# Altium schematic sheet [3]-MCU.SchDoc
size A4
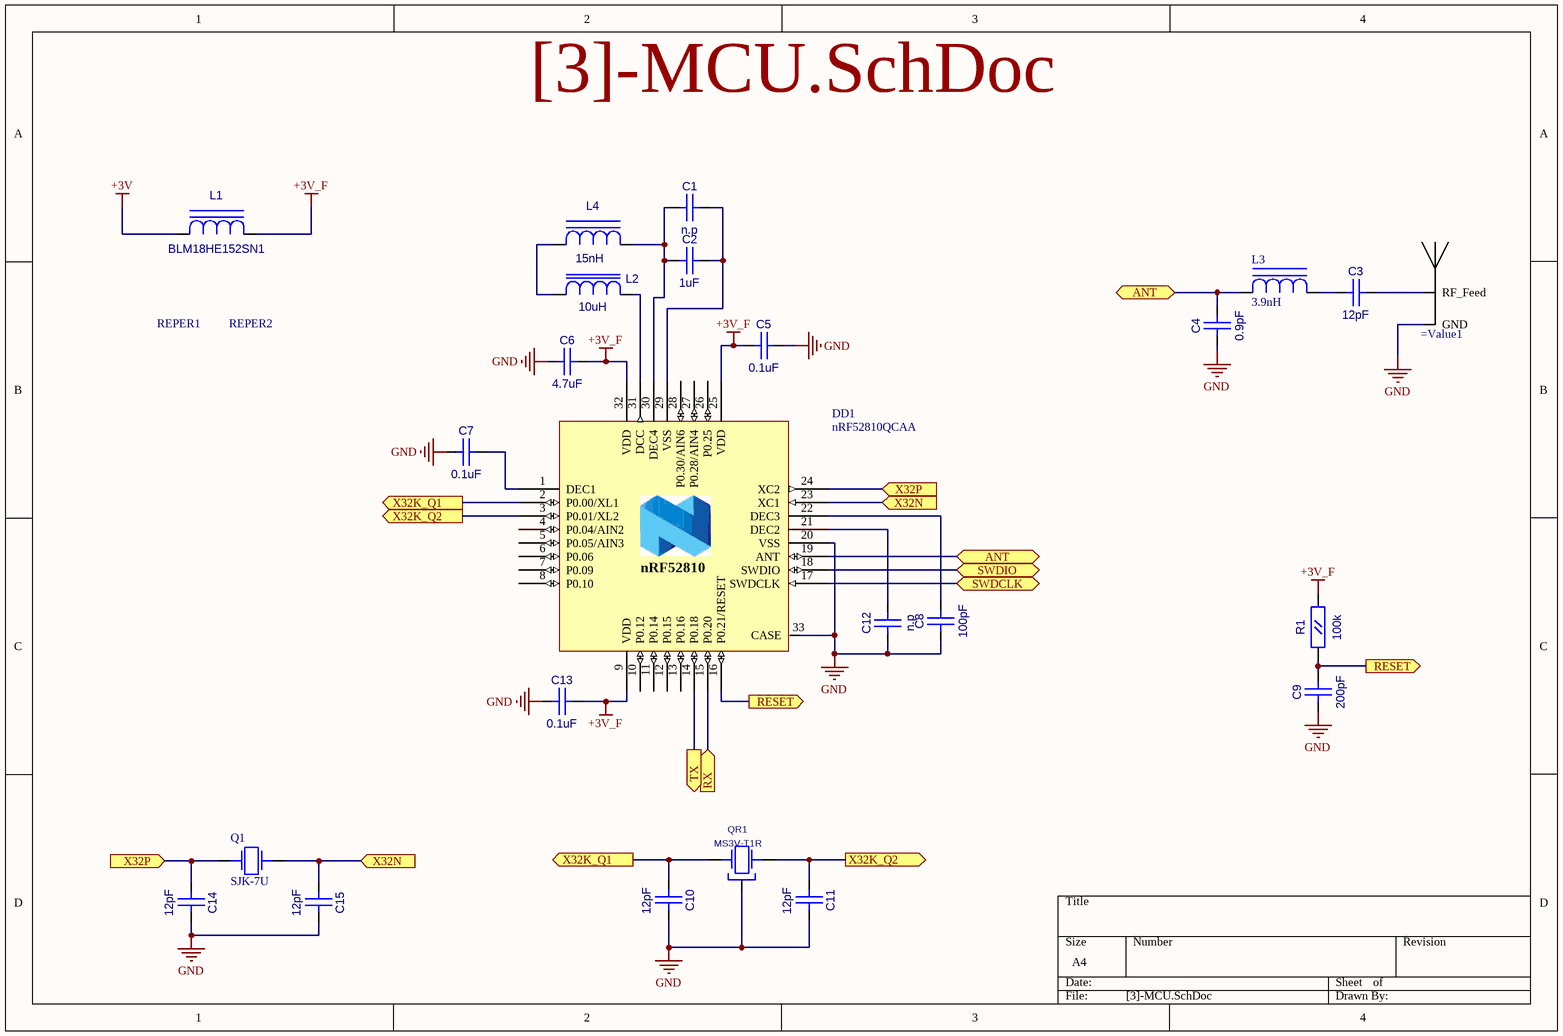
[diagram p0: [3]-MCU.SchDoc]

## Parts
=Value1  ANTENNA_IFA_245_1MM  [IFA245_1mm]  (value not drawn)
C1  n.p  [CC0805]
C2  1uF  [CC0603]
C3  12pF  [CC0603]
C4  0.9pF  [CC0603]
C5  0.1uF  [CC0603]
C6  4.7uF  [CC0805]
C7  0.1uF  [CC0603]
C8  100pF  [CC0603]
C9  200pF  [CC0603]
C10  12pF  [CC0603]
C11  12pF  [CC0603]
C12  n.p  [CC0603]
C13  0.1uF  [CC0603]
C14  12pF  [CC0603]
C15  12pF  [CC0603]
DD1  nRF52810QCAA  [QFN-32]
L1  BLM18HE152SN1  [L0603]
L2  10uH  [RC0805]
L3  3.9nH  [L0402]
L4  value 15nH  [L0603]  (hidden comment: L0603)
Q1  SJK-7U  [QUARTZ_3225_4]
QR1  MS3V-T1R  [MS3V-T1R]
R1  100k  [RC0603]
REPER1  REPER1.2  [REPER1.2]  (value not drawn)
REPER2  REPER1.2  [REPER1.2]  (value not drawn)

## Ports
ANT (bidir), RESET (out), RX (in), SWDCLK (bidir), SWDIO (bidir), TX (out), X32K_Q1 (out), X32K_Q2 (out), X32N (in), X32P (in)

## Nets
+3V: L1.1(A)
+3V_F: C5.1(A) C6.2(B) C13.2(B) DD1.9(VDD) DD1.25(VDD) DD1.32(VDD) L1.2(C) R1.2(B)
GND: =Value1.2(GND) C4.1(A) C5.2(B) C6.1(A) C7.1(A) C8.1(A) C9.1(A) C10.2(B) C11.2(B) C12.1(A) C13.1(A) C14.2(B) C15.2(B) DD1.20(VSS) DD1.33(CASE) QR1.3
ANT: C4.2(B) DD1.19(ANT) L3.1(A) ; port ANT
RESET: C9.2(B) DD1.16(P0.21/RESET) R1.1(A) ; port RESET
RX: DD1.15(P0.20) ; port RX
SWDCLK: DD1.17(SWDCLK) ; port SWDCLK
SWDIO: DD1.18(SWDIO) ; port SWDIO
TX: DD1.14(P0.18) ; port TX
X32K_Q1: C10.1(A) DD1.2(P0.00/XL1) QR1.2(X2) ; port X32K_Q1
X32K_Q2: C11.1(A) DD1.3(P0.01/XL2) QR1.1(X1) ; port X32K_Q2
X32N: C15.1(A) DD1.23(XC1) Q1.3 ; port X32N
X32P: C14.1(A) DD1.24(XC2) Q1.1 ; port X32P
Net=Value1_1: =Value1.1(RF_Feed) C3.2(B)
NetC1_1: C1.1(A) C2.1(A) DD1.30(DEC4) L4.2(C)
NetC1_2: C1.2(B) C2.2(B) DD1.29(VSS)
NetC3_1: C3.1(A) L3.2(C)
NetC7_2: C7.2(B) DD1.1(DEC1)
NetC8_2: C8.2(B) DD1.22(DEC3)
NetC12_2: C12.2(B) DD1.21(DEC2)
NetDD1_31: DD1.31(DCC) L2.2(B)
NetL2_1: L2.1(A) L4.1(A)

Not connected (* = marked no-connect by the designer): DD1 4(P0.04/AIN2) 5(P0.05/AIN3) 6(P0.06) 7(P0.09) 8(P0.10) 10(P0.12) 11(P0.14) 12(P0.15) 13(P0.16) 26(P0.25) 27(P0.28/AIN4) 28(P0.30/AIN6); REPER1 1; REPER2 1

## Notes on the sheet
- (in symbol NRF52810QCAA) nRF52810

## Library data of the parts
=Value1 = ANTENNA_IFA_245_1MM: Antenna 2.45GHz; Value: IFA 2.45GHz
C1 C6 = CC0805
  C1: Value: n.p
  C6: Value: 4.7uF
C2-C5 C7-C15 = CC0603
  C2: Value: 1uF
  C3 C10 C11 C14 C15: Value: 12pF
  C4: Value: 0.9pF
  C5 C7 C13: Value: 0.1uF
  C8: Value: 100pF
  C9: Value: 200pF
  C12: Value: n.p
DD1 = NRF52810QCAA: BLE 5 controller; Value: nRF52810QCAA
L1 = L0603: Value: BLM18HE152SN1
L2 = L0805: Value: 10uH
L3 = L0402: Value: 3.9nH
Q1 = SJK-7U: 3.2x2.5mm 4 pin SMD quartz crystal; Value: SJK-7U
QR1 = MS3V-T1R: CRYSTAL_32768 Hz; Value: *
R1 = RC0603: Value: 100k
REPER1 REPER2 = REPER1.2: Value: *